# Altium project Projekat.PrjPcb
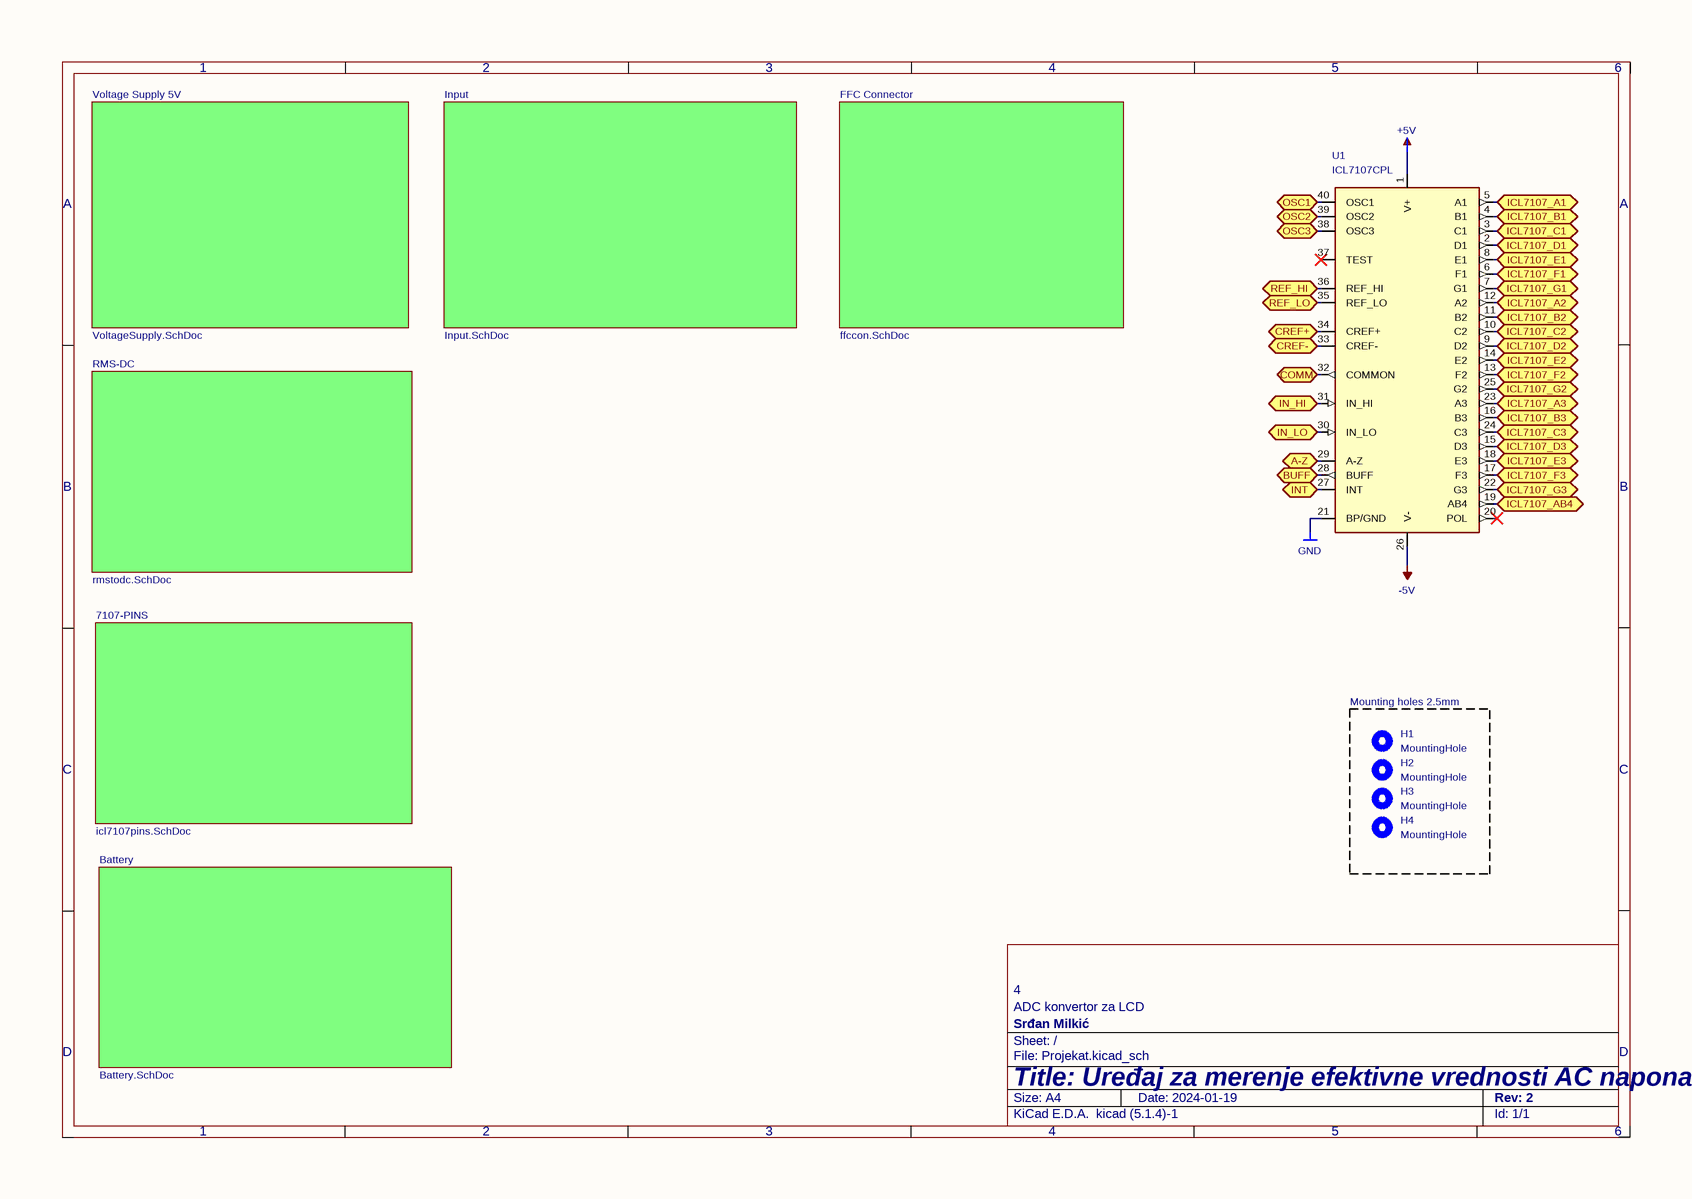
[diagram p0: Projekat.SchDoc]
8 sheets, 93 parts. Net scope: flat (ports and power ports of the same name join across sheets).
Board file: Projekat.PcbDoc
Sheets:
  Projekat.SchDoc
    Input = Input.SchDoc
    7107-PINS = icl7107pins.SchDoc
    Battery = Battery.SchDoc
    RMS-DC = rmstodc.SchDoc
    Voltage Supply 5V = VoltageSupply.SchDoc
    FFC Connector = ffccon.SchDoc
  lcdcontroll.SchDoc

## Sheet Projekat.SchDoc
size 297 x 209 mm

### Parts
#PWR1  GND
#PWR02  +5V
#PWR03  -5V
H1  MountingHole  [MountingHole_2.5mm]
H2  MountingHole  [MountingHole_2.5mm]
H3  MountingHole  [MountingHole_2.5mm]
H4  MountingHole  [MountingHole_2.5mm]
U1  ICL7107CPL  [DIP-40_W15.24mm]

### Blocks framed on the sheet
Mounting holes 2.5mm /: H1-H4

### Sub-sheets
7107-PINS = icl7107pins.SchDoc: no entries
Battery = Battery.SchDoc: no entries
FFC Connector = ffccon.SchDoc: no entries
Input = Input.SchDoc: no entries
RMS-DC = rmstodc.SchDoc: no entries
Voltage Supply 5V = VoltageSupply.SchDoc: no entries

### Ports
A-Z (bidir), BUFF (bidir), COMM (bidir), CREF+ (bidir), CREF- (bidir), ICL7107_A1 (bidir), ICL7107_A2 (bidir), ICL7107_A3 (bidir), ICL7107_AB4 (bidir), ICL7107_B1 (bidir), ICL7107_B2 (bidir), ICL7107_B3 (bidir), ICL7107_C1 (bidir), ICL7107_C2 (bidir), ICL7107_C3 (bidir), ICL7107_D1 (bidir), ICL7107_D2 (bidir), ICL7107_D3 (bidir), ICL7107_E1 (bidir), ICL7107_E2 (bidir), ICL7107_E3 (bidir), ICL7107_F1 (bidir), ICL7107_F2 (bidir), ICL7107_F3 (bidir), ICL7107_G1 (bidir), ICL7107_G2 (bidir), ICL7107_G3 (bidir), IN_HI (bidir), IN_LO (bidir), INT (bidir), OSC1 (bidir), OSC2 (bidir), OSC3 (bidir), REF_HI (bidir), REF_LO (bidir)

### Nets
A-Z: U1.29(A-Z) ; port A-Z
AD737_COM: U1.30(IN_LO) U1.32(COMMON) U1.35(REF_LO) ; port COMM, port REF_LO, port IN_LO
BUFF: U1.28(BUFF) ; port BUFF
CREF+: U1.34(CREF+) ; port CREF+
CREF-: U1.33(CREF-) ; port CREF-
ICL7107_A1: U1.5(A1) ; port ICL7107_A1
ICL7107_A2: U1.12(A2) ; port ICL7107_A2
ICL7107_A3: U1.23(A3) ; port ICL7107_A3
ICL7107_AB4: U1.19(AB4) ; port ICL7107_AB4
ICL7107_B1: U1.4(B1) ; port ICL7107_B1
ICL7107_B2: U1.11(B2) ; port ICL7107_B2
ICL7107_B3: U1.16(B3) ; port ICL7107_B3
ICL7107_C1: U1.3(C1) ; port ICL7107_C1
ICL7107_C2: U1.10(C2) ; port ICL7107_C2
ICL7107_C3: U1.24(C3) ; port ICL7107_C3
ICL7107_D1: U1.2(D1) ; port ICL7107_D1
ICL7107_D2: U1.9(D2) ; port ICL7107_D2
ICL7107_D3: U1.15(D3) ; port ICL7107_D3
ICL7107_E1: U1.8(E1) ; port ICL7107_E1
ICL7107_E2: U1.14(E2) ; port ICL7107_E2
ICL7107_E3: U1.18(E3) ; port ICL7107_E3
ICL7107_F1: U1.6(F1) ; port ICL7107_F1
ICL7107_F2: U1.13(F2) ; port ICL7107_F2
ICL7107_F3: U1.17(F3) ; port ICL7107_F3
ICL7107_G1: U1.7(G1) ; port ICL7107_G1
ICL7107_G2: U1.25(G2) ; port ICL7107_G2
ICL7107_G3: U1.22(G3) ; port ICL7107_G3
IN_HI: U1.31(IN_HI) ; port IN_HI
INT: U1.27(INT) ; port INT
OSC1: U1.40(OSC1) ; port OSC1
OSC2: U1.39(OSC2) ; port OSC2
OSC3: U1.38(OSC3) ; port OSC3
REF_HI: U1.36(REF_HI) ; port REF_HI
Net#PWR02_1: #PWR02.1(+5V) U1.1(V+)
Net#PWR03_1: #PWR03.1(-5V) U1.26(V-)

Not connected (* = marked no-connect by the designer): #PWR1 1(GND); U1 20(POL)* 21(BP/GND) 37(TEST)*

### Notes on the sheet
- 1
- 2
- 3
- 4
- 5
- 6
- A
- B
- C
- ADC konvertor za LCD
- D
- Title: Uređaj za merenje efektivne vrednosti AC napona
- File: Projekat.kicad_sch
- Sheet: /
- Srđan Milkić
- KiCad E.D.A.  kicad (5.1.4)-1
- Size: A4
- Date: 2024-01-19
- Rev: 2
- Id: 1/1

### Library data of the parts
#PWR1 = GND: Value: GND
#PWR02 = +5V: Value: +5V
#PWR03 = -5V: Value: -5V
H1-H4 = MountingHole: Value: MountingHole; Footprint: MountingHole:MountingHole_2.5mm
U1 = ICL7107CPL: Value: ICL7107CPL; Footprint: Package_DIP:DIP-40_W15.24mm

## Sheet Input.SchDoc
size 297 x 209 mm
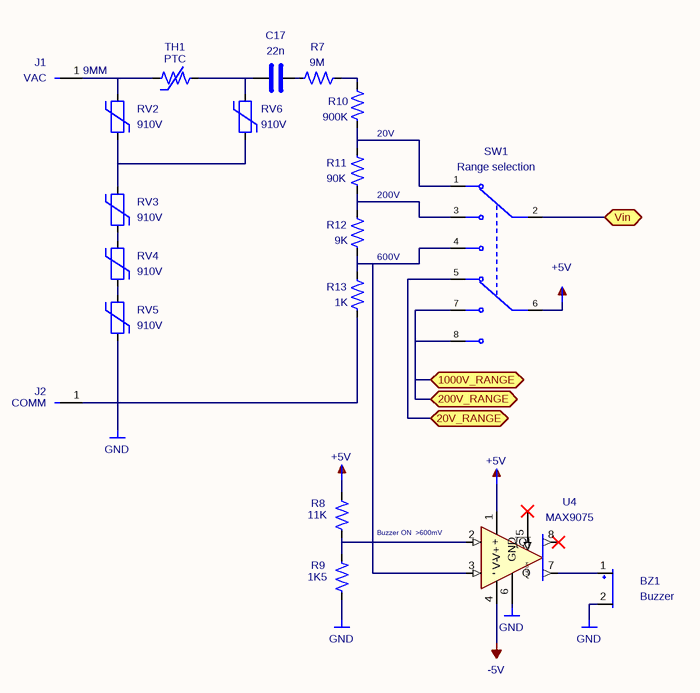
[diagram p1: Input.SchDoc]

### Parts
#PWR15  GND
#PWR016  +5V
#PWR17  GND
#PWR018  +5V
#PWR019  -5V
#PWR20  GND
#PWR021  +5V
#PWR22  GND
BZ1  Buzzer  [Buzzer_12x9.5RM7.6]
C17  22n  [C_Rect_L7.2mm_W11.0mm_P5.00mm_FKS2_FKP2_MKS2_MKP2]
J1  VAC  [TE_350180]
J2  COMM  [TE_350180]
R7  9M  [R_1210_3225Metric]
R8  11K  [R_1206_3216Metric]
R9  1K5  [R_1206_3216Metric]
R10  900K  [R_1210_3225Metric]
R11  90K  [R_1206_3216Metric]
R12  9K  [R_1206_3216Metric]
R13  1K  [R_1206_3216Metric]
RV2  910V  [RV_Disc_D12mm_W3.9mm_P7.5mm]
RV3  910V  [RV_Disc_D12mm_W3.9mm_P7.5mm]
RV4  910V  [RV_Disc_D12mm_W3.9mm_P7.5mm]
RV5  910V  [RV_Disc_D12mm_W3.9mm_P7.5mm]
RV6  910V  [RV_Disc_D12mm_W3.9mm_P7.5mm]
SW1  Range selection  [SW_EG2310]
TH1  PTC  [R_Axial_DIN0414_L11.9mm_D4.5mm_P7.62mm_Vertical]
U4  MAX9075  [SOT-23-8]

### Ports
20V_RANGE (bidir), 200V_RANGE (bidir), 1000V_RANGE (bidir), Vin (bidir)

### Nets
20V_RANGE: SW1.5 ; port 20V_RANGE
1000V_RANGE: SW1.7 SW1.8 ; port 200V_RANGE, port 1000V_RANGE
Vin: SW1.2 ; port Vin
Net#PWR016_1: #PWR016.1(+5V) R8.1
Net#PWR018_1: #PWR018.1(+5V) U4.1(V+)
Net#PWR019_1: #PWR019.1(-5V) U4.4(V-)
Net#PWR021_1: #PWR021.1(+5V) SW1.6
NetBZ1_1: BZ1.1(-) U4.7(Q)
NetC17_1: C17.1 RV6.1 TH1.2
NetC17_2: C17.2 R7.1
NetJ1_1: J1.1(Pin_1) RV2.1 TH1.1
NetJ2_1: J2.1(Pin_1) R13.2 RV5.2
NetR7_2: R7.2 R10.2
NetR8_2: R8.2 R9.1 U4.2(+)
NetR10_1: R10.1 R11.1 SW1.1
NetR11_2: R11.2 R12.1 SW1.3
NetR12_2: R12.2 R13.1 SW1.4 U4.3(-)
NetRV2_2: RV2.2 RV3.1 RV6.2
NetRV3_2: RV3.2 RV4.1
NetRV4_2: RV4.2 RV5.1

Not connected (* = marked no-connect by the designer): #PWR15 1(GND); #PWR17 1(GND); #PWR20 1(GND); #PWR22 1(GND); BZ1 2(+); R9 2; U4 5(LATCH)* 6(GND) 8(~{{Q}})*

### Notes on the sheet
- 9MM
- 20V
- 200V
- 600V
- Buzzer ON  >600mV
- 1
- 2
- 3
- 4
- 5
- 6
- A
- B
- C
- Izbor opsega
- Zujalica za prekomerni napon
- Zaštita ulaza
- D
- Title: Uređaj za merenje efektivne vrednosti AC napona
- File: Input.kicad_sch
- Sheet: /
- Srđan Milkić
- KiCad E.D.A.  kicad (5.1.4)-1
- Size: A4
- Date: 2024-01-19
- Rev: 2
- Id: 1/1

### Library data of the parts
#PWR17 = GND_2: Value: GND
#PWR20 #PWR22 = GND_1: Value: GND
C17 = C: Rated Voltage: 1200V; Value: 22n; Footprint: Capacitor_THT:C_Rect_L7.2mm_W11.0mm_P5.00mm_FKS2_FKP2_MKS2_MKP2
J1 J2 = Conn_01x01_Female: Footprint: priums_lib:TE_350180
  J1: Value: VAC
  J2: Value: COMM
R7-R13 = R_US
  R7: Value: 9M; Footprint: Resistor_SMD:R_1210_3225Metric
  R8: Value: 11K; Footprint: Resistor_SMD:R_1206_3216Metric
  R9: Value: 1K5; Footprint: Resistor_SMD:R_1206_3216Metric
  R10: Value: 900K; Footprint: Resistor_SMD:R_1210_3225Metric
  R11: Value: 90K; Footprint: Resistor_SMD:R_1206_3216Metric
  R12: Value: 9K; Footprint: Resistor_SMD:R_1206_3216Metric
  R13: Value: 1K; Footprint: Resistor_SMD:R_1206_3216Metric
RV2 = Varistor_1: Value: 910V; Footprint: Varistor:RV_Disc_D12mm_W3.9mm_P7.5mm
RV3 = Varistor_2: Value: 910V; Footprint: Varistor:RV_Disc_D12mm_W3.9mm_P7.5mm
RV4 = Varistor_3: Value: 910V; Footprint: Varistor:RV_Disc_D12mm_W3.9mm_P7.5mm
RV5 = Varistor: Value: 910V; Footprint: Varistor:RV_Disc_D12mm_W3.9mm_P7.5mm
RV6 = Varistor_4: Value: 910V; Footprint: Varistor:RV_Disc_D12mm_W3.9mm_P7.5mm
SW1 = EG2310: MF: E-Switch; Description: \nSlide Switch DP3T Through Hole, Right Angle\n; MAXIMUM_PACKAGE_HEIGHT: 4.7mm; Package: None; Price: None; Check_prices: https://www.snapeda.com/parts/EG2310/E-Switch/view-part/?ref=eda; STANDARD: Manufacturer Recommendations; PARTREV: -; SnapEDA_Link: https://www.snapeda.com/parts/EG2310/E-Switch/view-part/?ref=snap; MP: EG2310; Purchase-URL: https://www.snapeda.com/api/url_track_click_mouser/?unipart_id=396456&manufacturer=E-Switch&part_name=EG2310&search_term=None; MANUFACTURER: E-Switch; Availability: In Stock; SNAPEDA_PN: EG2310; Value: Range selection; Footprint: priums_lib:SW_EG2310
TH1 = Thermistor_US: Value: PTC; Footprint: Resistor_THT:R_Axial_DIN0414_L11.9mm_D4.5mm_P7.62mm_Vertical
U4 = AD8561: Value: MAX9075; Footprint: Package_TO_SOT_SMD:SOT-23-8
#PWR15 = GND: Value: GND
#PWR016 #PWR018 #PWR021 = +5V: Value: +5V
#PWR019 = -5V: Value: -5V
BZ1 = Buzzer: Value: Buzzer; Footprint: Buzzer_Beeper:Buzzer_12x9.5RM7.6

## Sheet icl7107pins.SchDoc
size 297 x 209 mm
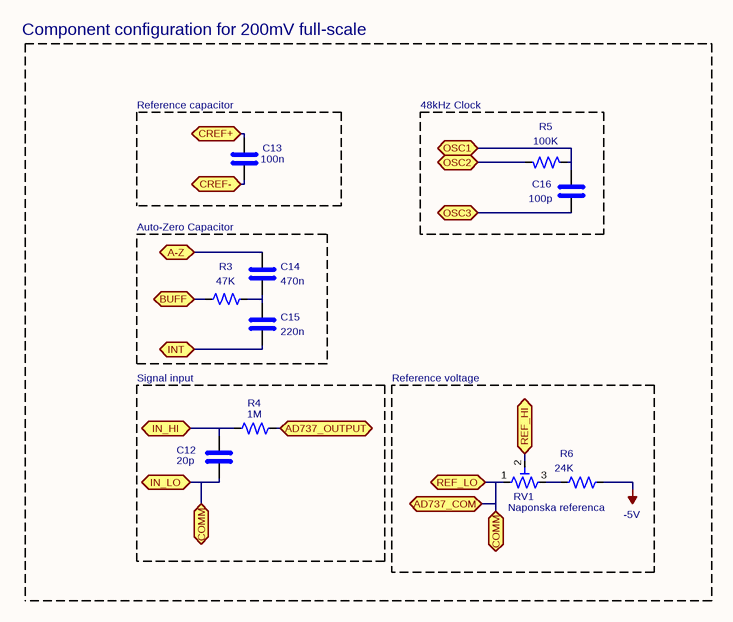
[diagram p2: icl7107pins.SchDoc]

### Parts
#PWR014  -5V
C12  20p  [C_1210_3225Metric]
C13  100n  [C_1210_3225Metric]
C14  470n  [C_1206_3216Metric]
C15  220n  [C_1206_3216Metric]
C16  100p  [C_1206_3216Metric]
R3  47K  [R_1206_3216Metric]
R4  1M  [R_1812_4532Metric]
R5  100K  [R_1206_3216Metric]
R6  24K  [R_1206_3216Metric]
RV1  Naponska referenca  [Potentiometer_Bourns_3266W_Vertical]

### Blocks framed on the sheet
Reference capacitor /: C13
48kHz Clock: C16 R5
Auto-Zero Capacitor /: C14 C15 R3
Signal input: C12 R4
Reference voltage: #PWR014 R6 RV1

### Ports
A-Z (bidir), AD737_COM (bidir), AD737_OUTPUT (bidir), BUFF (bidir), COMM (bidir), CREF+ (bidir), CREF- (bidir), IN_HI (bidir), IN_LO (bidir), INT (bidir), OSC1 (bidir), OSC2 (bidir), OSC3 (bidir), REF_HI (bidir), REF_LO (bidir)

### Nets
A-Z: C14.2 ; port A-Z
AD737_COM: C12.2 RV1.1 ; port AD737_COM, port REF_LO, port COMM, port IN_LO
AD737_OUTPUT: R4.2 ; port AD737_OUTPUT
BUFF: R3.1 ; port BUFF
CREF+: C13.1 ; port CREF+
CREF-: C13.2 ; port CREF-
IN_HI: C12.1 R4.1 ; port IN_HI
INT: C15.1 ; port INT
OSC1: C16.1 R5.1 ; port OSC1
OSC2: R5.2 ; port OSC2
OSC3: C16.2 ; port OSC3
REF_HI: RV1.2 ; port REF_HI
Net#PWR014_1: #PWR014.1(-5V) R6.1
NetC14_1: C14.1 C15.2 R3.2
NetR6_2: R6.2 RV1.3

### Notes on the sheet
- Component configuration for 200mV full-scale
- 1
- 2
- 3
- 4
- 5
- 6
- A
- B
- C
- Konfiguracija ICL7107 ADC konvertora
- D
- Title: Uređaj za merenje efektivne vrednosti AC napona
- File: icl7107pins.kicad_sch
- Sheet: /
- Srđan Milkić
- KiCad E.D.A.  kicad (5.1.4)-1
- Size: A4
- Date: 2024-01-19
- Rev: 2
- Id: 1/1

### Library data of the parts
C12-C16 = C
  C12: Value: 20p; Footprint: Capacitor_SMD:C_1210_3225Metric
  C13: Value: 100n; Footprint: Capacitor_SMD:C_1210_3225Metric
  C14: Value: 470n; Footprint: Capacitor_SMD:C_1206_3216Metric
  C15: Value: 220n; Footprint: Capacitor_SMD:C_1206_3216Metric
  C16: Value: 100p; Footprint: Capacitor_SMD:C_1206_3216Metric
R3-R6 = R_US
  R3: Value: 47K; Footprint: Resistor_SMD:R_1206_3216Metric
  R4: Value: 1M; Footprint: Resistor_SMD:R_1812_4532Metric
  R5: Value: 100K; Footprint: Resistor_SMD:R_1206_3216Metric
  R6: Value: 24K; Footprint: Resistor_SMD:R_1206_3216Metric
RV1 = R_Potentiometer_Trim_US: Value: Naponska referenca; Footprint: Potentiometer_THT:Potentiometer_Bourns_3266W_Vertical
#PWR014 = -5V: Value: -5V

## Sheet Battery.SchDoc
size 297 x 209 mm
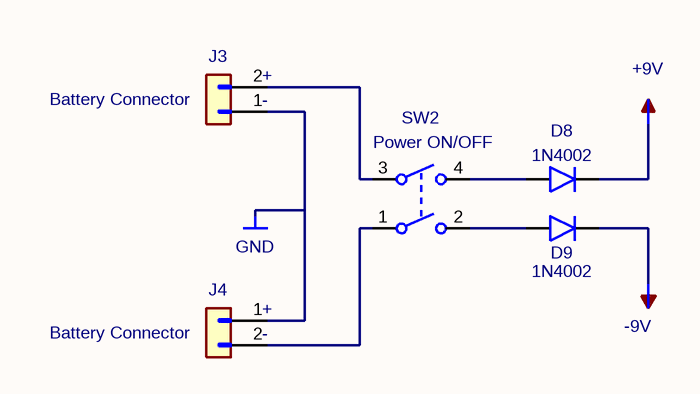
[diagram p3: Battery.SchDoc]

### Parts
#PWR23  GND
#PWR024  +9V
#PWR025  -9V
D8  1N4002  [D_DO-41_SOD81_P10.16mm_Horizontal]
D9  1N4002  [D_DO-41_SOD81_P10.16mm_Horizontal]
J3  Battery Connector  [PinHeader_1x02_P2.54mm_Vertical]
J4  Battery Connector  [PinHeader_1x02_P2.54mm_Vertical]
SW2  Power ON/OFF  [SW_CuK_JS202011AQN_DPDT_Angled]

### Nets
Net#PWR024_1: #PWR024.1(+9V) D8.1(K)
Net#PWR025_1: #PWR025.1(-9V) D9.1(K)
NetD8_2: D8.2(A) SW2.4
NetD9_2: D9.2(A) SW2.2
NetJ3_1: J3.1(Pin_1) J4.1(Pin_1)
NetJ3_2: J3.2(Pin_2) SW2.3
NetJ4_2: J4.2 SW2.1

Not connected (* = marked no-connect by the designer): #PWR23 1(GND)

### Notes on the sheet
- (near J3) +
- (near J3) -
- (near J4) -
- (near J4) +
- 1
- 2
- 3
- 4
- 5
- 6
- A
- B
- C
- Baterijsko napajanje
- D
- Title: Uređaj za merenje efektivne vrednosti AC napona
- File: Battery.kicad_sch
- Sheet: /
- Srđan Milkić
- KiCad E.D.A.  kicad (5.1.4)-1
- Size: A4
- Date: 2024-01-19
- Rev: 2
- Id: 1/1

### Library data of the parts
J3 = Conn_01x02_1: Value: Battery Connector; Footprint: Connector_PinHeader_2.54mm:PinHeader_1x02_P2.54mm_Vertical
J4 = Conn_01x02: Value: Battery Connector; Footprint: Connector_PinHeader_2.54mm:PinHeader_1x02_P2.54mm_Vertical
SW2 = SW_DPST: Value: Power ON/OFF; Footprint: Button_Switch_THT:SW_CuK_JS202011AQN_DPDT_Angled
#PWR23 = GND: Value: GND
#PWR024 = +9V: Value: +9V
#PWR025 = -9V: Value: -9V
D8 D9 = 1N4002: Value: 1N4002; Footprint: Diode_THT:D_DO-41_SOD81_P10.16mm_Horizontal

## Sheet rmstodc.SchDoc
size 297 x 209 mm
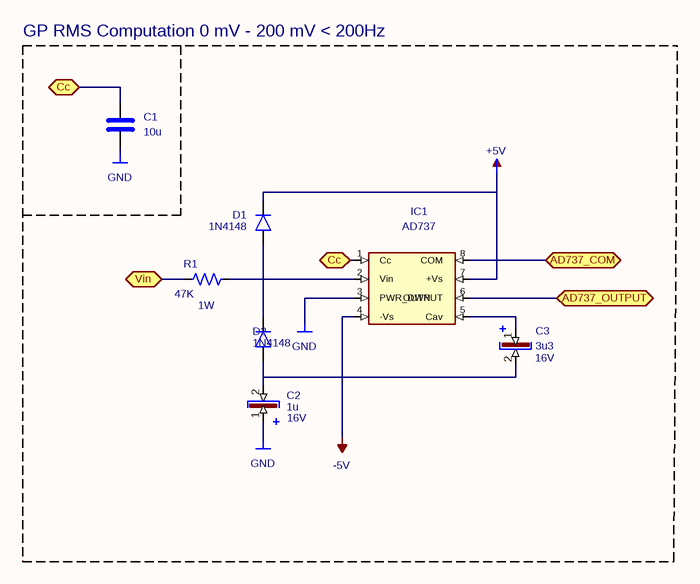
[diagram p4: rmstodc.SchDoc]

### Parts
#PWR4  GND
#PWR5  GND
#PWR6  GND
#PWR07  -5V
#PWR08  +5V
C1  10u  [C_1206_3216Metric]
C2  Rated Voltage: 16V  [C_1210_3225Metric]  (hidden comment: 1u)
C3  Rated Voltage: 16V  [C_1210_3225Metric]  (hidden comment: 3u3)
D1  1N4148  [D_DO-35_SOD27_P7.62mm_Horizontal]
D2  1N4148  [D_DO-35_SOD27_P7.62mm_Horizontal]
IC1  AD737  [DIP-8_W10.16mm]
R1  Power Rating: 1W  [R_1206_3216Metric]  (hidden comment: 47K)

### Blocks framed on the sheet
GP RMS Computation / 0 mV - 200 mV / < 200Hz: #PWR4-#PWR6 #PWR07 #PWR08 C1-C3 D1 D2 IC1 R1

### Ports
AD737_COM (bidir), AD737_OUTPUT (bidir), Cc (bidir), Vin (bidir)

### Nets
AD737_COM: IC1.8(COM) ; port AD737_COM
AD737_OUTPUT: IC1.6(OUTPUT) ; port AD737_OUTPUT
Cc: C1.1 IC1.1(Cc) ; port Cc
Vin: R1.2 ; port Vin
Net#PWR07_1: #PWR07.1(-5V) C2.2 C3.2 D2.2(A) IC1.4(-Vs)
Net#PWR08_1: #PWR08.1(+5V) D1.1(K) IC1.7(+Vs)
NetC3_1: C3.1 IC1.5(Cav)
NetD1_2: D1.2(A) D2.1(K) IC1.2(Vin) R1.1

Not connected (* = marked no-connect by the designer): #PWR4 1(GND); #PWR5 1(GND); #PWR6 1(GND); C1 2; C2 1; IC1 3(PWR_DWN)

### Notes on the sheet
- 1
- 2
- 3
- 4
- 5
- 6
- A
- B
- C
- AC - DC konvertor
- D
- Title: Uređaj za merenje efektivne vrednosti AC napona
- File: rmstodc.kicad_sch
- Sheet: /
- Srđan Milkić
- KiCad E.D.A.  kicad (5.1.4)-1
- Size: A4
- Date: 2024-01-19
- Rev: 2
- Id: 1/1

### Library data of the parts
#PWR4 = GND_1: Value: GND
#PWR5 = GND_2: Value: GND
C1 = C: Value: 10u; Footprint: Capacitor_SMD:C_1206_3216Metric
C2 = Cap_pol: Value: 1u; Footprint: Capacitor_SMD:C_1210_3225Metric
C3 = Cap_pol_1: Value: 3u3; Footprint: Capacitor_SMD:C_1210_3225Metric
D1 = 1N4148_1: Value: 1N4148; Footprint: Diode_THT:D_DO-35_SOD27_P7.62mm_Horizontal
R1 = R_US: Value: 47K; Footprint: Resistor_SMD:R_1206_3216Metric
#PWR6 = GND: Value: GND
#PWR07 = -5V: Value: -5V
#PWR08 = +5V: Value: +5V
D2 = 1N4148: Value: 1N4148; Footprint: Diode_THT:D_DO-35_SOD27_P7.62mm_Horizontal
IC1 = AD737: Value: AD737; Footprint: Package_DIP:DIP-8_W10.16mm

## Sheet VoltageSupply.SchDoc
size 297 x 209 mm
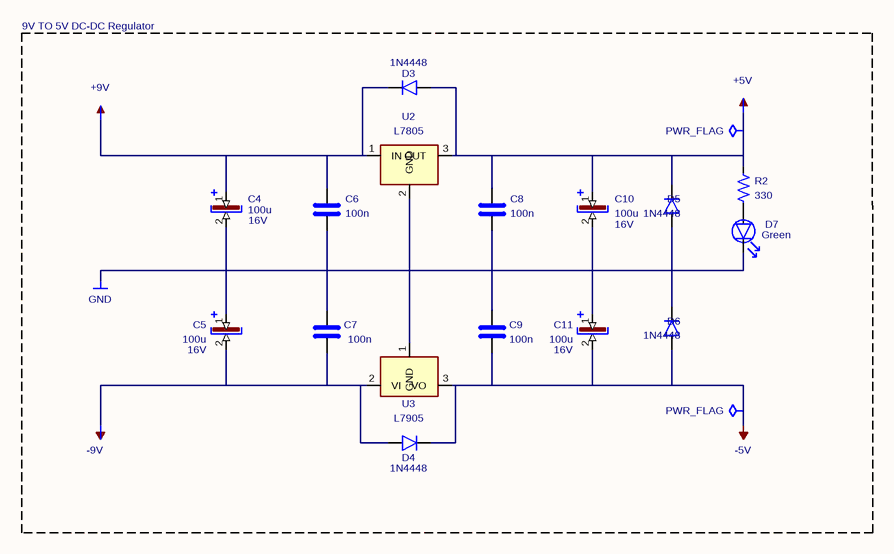
[diagram p5: VoltageSupply.SchDoc]

### Parts
(Parts that share a designator on the sheet are numbered #1, #2 ... from top to bottom, then left to right.)
#FLG01  PWR_FLAG  (graphical)
#FLG02  PWR_FLAG  (graphical)
#PWR09  +9V
#PWR10  GND
#PWR011  -9V
#PWR012  +5V
#PWR013  -5V
C4  Rated Voltage: 16V  [C_1210_3225Metric]  (hidden comment: 100u)
C5  Rated Voltage: 16V  [C_1210_3225Metric]  (hidden comment: 100u)
C6  100n  [C_1210_3225Metric]
C7  100n  [C_1210_3225Metric]
C8  100n  [C_1210_3225Metric]
C9  100n  [C_1210_3225Metric]
C10  Rated Voltage: 16V  [C_1206_3216Metric]  (hidden comment: 100u)
C11  Rated Voltage: 16V  [C_1206_3216Metric]  (hidden comment: 100u)
D3  1N4448  [D_DO-35_SOD27_P7.62mm_Horizontal]
D4  1N4448  [D_DO-35_SOD27_P7.62mm_Horizontal]
D5  1N4448  [D_DO-35_SOD27_P7.62mm_Horizontal]
D6  1N4448  [D_DO-35_SOD27_P7.62mm_Horizontal]
D7  Green  [LED_D5.0mm_Horizontal_O6.35mm_Z15.0mm]
R2  330  [R_1206_3216Metric]
U2#1  L7805  [TO-220-3_Vertical]
U3  L7905  [TO-220-3_Vertical]

### Blocks framed on the sheet
9V TO 5V DC-DC Regulator /: #FLG01 #FLG02 #PWR09 #PWR10 #PWR011 #PWR012 #PWR013 C4-C11 D3-D7 R2 U2#1 U3

### Nets
Net#FLG01_1: #FLG01.1(pwr) #PWR012.1(+5V) C8.1 C10.1 D3.2(A) D5.1(K) R2.1 U2#1.3(OUT)
Net#FLG02_1: #FLG02.1(pwr) #PWR013.1(-5V) C9.1 C11.2 D4.1(K) D6.2(A) U3.3(VO)
Net#PWR09_1: #PWR09.1(+9V) C4.1 C6.1 D3.1(K) U2#1.1(IN)
Net#PWR011_1: #PWR011.1(-9V) C5.2 C7.1 D4.2(A) U3.2(VI)
NetC4_2: C4.2 C5.1 C6.2 C7.2 C8.2 C9.2 C10.2 C11.1 D5.2(A) D6.1(K) D7.1(K) U2#1.2(GND) U3.1(GND)
NetD7_2: D7.2(A) R2.2

Not connected (* = marked no-connect by the designer): #PWR10 1(GND)

### Notes on the sheet
- 1
- 2
- 3
- 4
- 5
- 6
- A
- B
- C
- Bipolarno napajanje za 5V
- D
- Title: Uređaj za merenje efektivne vrednosti AC napona
- File: VoltageSupply.kicad_sch
- Sheet: /
- Srđan Milkić
- KiCad E.D.A.  kicad (5.1.4)-1
- Size: A4
- Date: 2024-01-19
- Rev: 2
- Id: 1/1

### Library data of the parts
C4 C5 = Cap_pol: Value: 100u; Footprint: Capacitor_SMD:C_1210_3225Metric
C6-C9 = C: Value: 100n; Footprint: Capacitor_SMD:C_1210_3225Metric
C10 = Cap_pol_2: Value: 100u; Footprint: Capacitor_SMD:C_1206_3216Metric
C11 = Cap_pol_1: Value: 100u; Footprint: Capacitor_SMD:C_1206_3216Metric
D7 = LED: Value: Green; Footprint: LED_THT:LED_D5.0mm_Horizontal_O6.35mm_Z15.0mm
R2 = R_US: Value: 330; Footprint: Resistor_SMD:R_1206_3216Metric
#FLG01 #FLG02 = PWR_FLAG: Value: PWR_FLAG
#PWR09 = +9V: Value: +9V
#PWR10 = GND: Value: GND
#PWR011 = -9V: Value: -9V
#PWR012 = +5V: Value: +5V
#PWR013 = -5V: Value: -5V
D3-D6 = 1N4448: Value: 1N4448; Footprint: Diode_THT:D_DO-35_SOD27_P7.62mm_Horizontal
U2#1 = L7805: Value: L7805; Footprint: Package_TO_SOT_THT:TO-220-3_Vertical
U3 = L7905: Value: L7905; Footprint: Package_TO_SOT_THT:TO-220-3_Vertical

## Sheet ffccon.SchDoc
size 297 x 209 mm
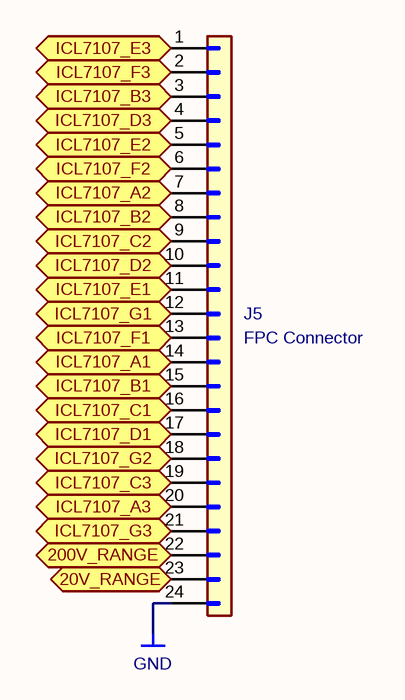
[diagram p6: ffccon.SchDoc]

### Parts
#PWR26  GND
J5  FPC Connector  [FPC_24]

### Ports
20V_RANGE (bidir), 200V_RANGE (bidir), ICL7107_A1 (bidir), ICL7107_A2 (bidir), ICL7107_A3 (bidir), ICL7107_B1 (bidir), ICL7107_B2 (bidir), ICL7107_B3 (bidir), ICL7107_C1 (bidir), ICL7107_C2 (bidir), ICL7107_C3 (bidir), ICL7107_D1 (bidir), ICL7107_D2 (bidir), ICL7107_D3 (bidir), ICL7107_E1 (bidir), ICL7107_E2 (bidir), ICL7107_E3 (bidir), ICL7107_F1 (bidir), ICL7107_F2 (bidir), ICL7107_F3 (bidir), ICL7107_G1 (bidir), ICL7107_G2 (bidir), ICL7107_G3 (bidir)

### Nets
20V_RANGE: J5.23(Pin_23) ; port 20V_RANGE
1000V_RANGE: J5.22(Pin_22) ; port 200V_RANGE
ICL7107_A1: J5.14(Pin_14) ; port ICL7107_A1
ICL7107_A2: J5.7(Pin_7) ; port ICL7107_A2
ICL7107_A3: J5.20(Pin_20) ; port ICL7107_A3
ICL7107_B1: J5.15(Pin_15) ; port ICL7107_B1
ICL7107_B2: J5.8(Pin_8) ; port ICL7107_B2
ICL7107_B3: J5.3(Pin_3) ; port ICL7107_B3
ICL7107_C1: J5.16(Pin_16) ; port ICL7107_C1
ICL7107_C2: J5.9(Pin_9) ; port ICL7107_C2
ICL7107_C3: J5.19(Pin_19) ; port ICL7107_C3
ICL7107_D1: J5.17(Pin_17) ; port ICL7107_D1
ICL7107_D2: J5.10(Pin_10) ; port ICL7107_D2
ICL7107_D3: J5.4(Pin_4) ; port ICL7107_D3
ICL7107_E1: J5.11(Pin_11) ; port ICL7107_E1
ICL7107_E2: J5.5(Pin_5) ; port ICL7107_E2
ICL7107_E3: J5.1(Pin_1) ; port ICL7107_E3
ICL7107_F1: J5.13(Pin_13) ; port ICL7107_F1
ICL7107_F2: J5.6(Pin_6) ; port ICL7107_F2
ICL7107_F3: J5.2(Pin_2) ; port ICL7107_F3
ICL7107_G1: J5.12(Pin_12) ; port ICL7107_G1
ICL7107_G2: J5.18(Pin_18) ; port ICL7107_G2
ICL7107_G3: J5.21(Pin_21) ; port ICL7107_G3

Not connected (* = marked no-connect by the designer): #PWR26 1(GND); J5 24(Pin_24)

### Notes on the sheet
- 1
- 2
- 3
- 4
- 5
- 6
- A
- B
- C
- Konektor FFC trake za povezivanje LCD-a
- D
- Title: Uređaj za merenje efektivne vrednosti AC napona
- File: ffccon.kicad_sch
- Sheet: /
- Srđan Milkić
- KiCad E.D.A.  kicad (5.1.4)-1
- Size: A4
- Date: 2024-01-19
- Rev: 2
- Id: 1/1

### Library data of the parts
J5 = Conn_01x24: Value: FPC Connector; Footprint: priums_lib:FPC_24
#PWR26 = GND: Value: GND

## Sheet lcdcontroll.SchDoc
size 297 x 209 mm
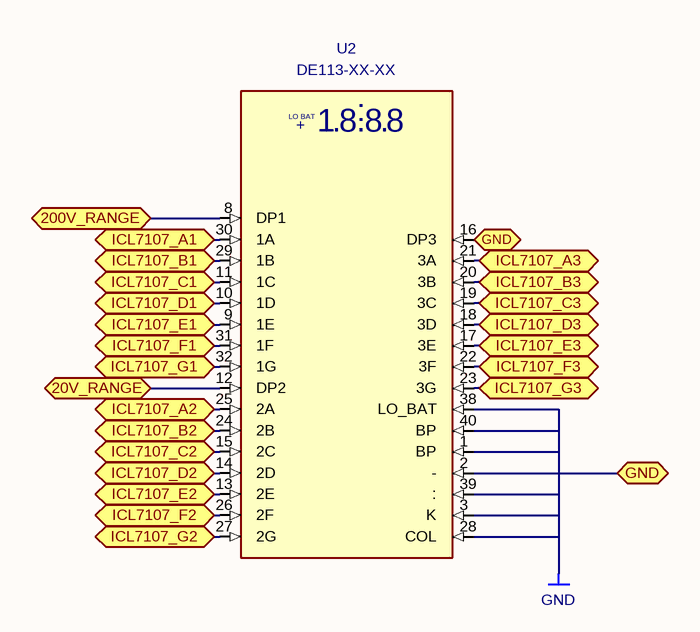
[diagram p7: lcdcontroll.SchDoc]

### Parts
(Parts that share a designator on the sheet are numbered #1, #2 ... from top to bottom, then left to right.)
#1  GND
U2#2  DE113-XX-XX  [DE113-XX-XX]

### Ports
20V_RANGE (bidir), 200V_RANGE (bidir), GND (bidir), ICL7107_A1 (bidir), ICL7107_A2 (bidir), ICL7107_A3 (bidir), ICL7107_B1 (bidir), ICL7107_B2 (bidir), ICL7107_B3 (bidir), ICL7107_C1 (bidir), ICL7107_C2 (bidir), ICL7107_C3 (bidir), ICL7107_D1 (bidir), ICL7107_D2 (bidir), ICL7107_D3 (bidir), ICL7107_E1 (bidir), ICL7107_E2 (bidir), ICL7107_E3 (bidir), ICL7107_F1 (bidir), ICL7107_F2 (bidir), ICL7107_F3 (bidir), ICL7107_G1 (bidir), ICL7107_G2 (bidir), ICL7107_G3 (bidir)

### Nets
20V_RANGE: U2#2.12(DP2) ; port 20V_RANGE
1000V_RANGE: U2#2.8(DP1) ; port 200V_RANGE
GND: U2#2.1(BP) U2#2.2(-) U2#2.3(K) U2#2.16(DP3) U2#2.28(COL) U2#2.38(LO_BAT) U2#2.39(:) U2#2.40(BP) ; port GND
ICL7107_A1: U2#2.30(1A) ; port ICL7107_A1
ICL7107_A2: U2#2.25(2A) ; port ICL7107_A2
ICL7107_A3: U2#2.21(3A) ; port ICL7107_A3
ICL7107_B1: U2#2.29(1B) ; port ICL7107_B1
ICL7107_B2: U2#2.24(2B) ; port ICL7107_B2
ICL7107_B3: U2#2.20(3B) ; port ICL7107_B3
ICL7107_C1: U2#2.11(1C) ; port ICL7107_C1
ICL7107_C2: U2#2.15(2C) ; port ICL7107_C2
ICL7107_C3: U2#2.19(3C) ; port ICL7107_C3
ICL7107_D1: U2#2.10(1D) ; port ICL7107_D1
ICL7107_D2: U2#2.14(2D) ; port ICL7107_D2
ICL7107_D3: U2#2.18(3D) ; port ICL7107_D3
ICL7107_E1: U2#2.9(1E) ; port ICL7107_E1
ICL7107_E2: U2#2.13(2E) ; port ICL7107_E2
ICL7107_E3: U2#2.17(3E) ; port ICL7107_E3
ICL7107_F1: U2#2.31(1F) ; port ICL7107_F1
ICL7107_F2: U2#2.26(2F) ; port ICL7107_F2
ICL7107_F3: U2#2.22(3F) ; port ICL7107_F3
ICL7107_G1: U2#2.32(1G) ; port ICL7107_G1
ICL7107_G2: U2#2.27(2G) ; port ICL7107_G2
ICL7107_G3: U2#2.23(3G) ; port ICL7107_G3

Not connected (* = marked no-connect by the designer): #1 1(GND); U2#2 4(NC) 5(NC) 6(NC) 7(NC) 33(NC) 34(NC) 35(NC) 36(NC) 37(NC)

### Notes on the sheet
- 1
- 2
- 3
- 4
- 5
- 6
- A
- B
- C
- D
- Title:
- File: lcdcontroll.kicad_sch
- Sheet: /
- KiCad E.D.A.  kicad (5.1.4)-1
- Size: A4
- Date:
- Rev:
- Id: 1/1
- (in symbol DE113-XX-XX) LO BAT; +; .

### Library data of the parts
#1 = GND: Value: GND
U2#2 = DE113-XX-XX: Value: DE113-XX-XX; Footprint: Display_7Segment:DE113-XX-XX

## Nets that join several sheets
20V_RANGE: Input (SW1.5), ffccon (J5.23), lcdcontroll (U2#2.12)
1000V_RANGE: Input (SW1.7 SW1.8), ffccon (J5.22), lcdcontroll (U2#2.8)
A-Z: Projekat (U1.29), icl7107pins (C14.2)
AD737_COM: Projekat (U1.30 U1.32 U1.35), icl7107pins (C12.2 RV1.1), rmstodc (IC1.8)
AD737_OUTPUT: icl7107pins (R4.2), rmstodc (IC1.6)
BUFF: Projekat (U1.28), icl7107pins (R3.1)
CREF+: Projekat (U1.34), icl7107pins (C13.1)
CREF-: Projekat (U1.33), icl7107pins (C13.2)
ICL7107_A1: Projekat (U1.5), ffccon (J5.14), lcdcontroll (U2#2.30)
ICL7107_A2: Projekat (U1.12), ffccon (J5.7), lcdcontroll (U2#2.25)
ICL7107_A3: Projekat (U1.23), ffccon (J5.20), lcdcontroll (U2#2.21)
ICL7107_B1: Projekat (U1.4), ffccon (J5.15), lcdcontroll (U2#2.29)
ICL7107_B2: Projekat (U1.11), ffccon (J5.8), lcdcontroll (U2#2.24)
ICL7107_B3: Projekat (U1.16), ffccon (J5.3), lcdcontroll (U2#2.20)
ICL7107_C1: Projekat (U1.3), ffccon (J5.16), lcdcontroll (U2#2.11)
ICL7107_C2: Projekat (U1.10), ffccon (J5.9), lcdcontroll (U2#2.15)
ICL7107_C3: Projekat (U1.24), ffccon (J5.19), lcdcontroll (U2#2.19)
ICL7107_D1: Projekat (U1.2), ffccon (J5.17), lcdcontroll (U2#2.10)
ICL7107_D2: Projekat (U1.9), ffccon (J5.10), lcdcontroll (U2#2.14)
ICL7107_D3: Projekat (U1.15), ffccon (J5.4), lcdcontroll (U2#2.18)
ICL7107_E1: Projekat (U1.8), ffccon (J5.11), lcdcontroll (U2#2.9)
ICL7107_E2: Projekat (U1.14), ffccon (J5.5), lcdcontroll (U2#2.13)
ICL7107_E3: Projekat (U1.18), ffccon (J5.1), lcdcontroll (U2#2.17)
ICL7107_F1: Projekat (U1.6), ffccon (J5.13), lcdcontroll (U2#2.31)
ICL7107_F2: Projekat (U1.13), ffccon (J5.6), lcdcontroll (U2#2.26)
ICL7107_F3: Projekat (U1.17), ffccon (J5.2), lcdcontroll (U2#2.22)
ICL7107_G1: Projekat (U1.7), ffccon (J5.12), lcdcontroll (U2#2.32)
ICL7107_G2: Projekat (U1.25), ffccon (J5.18), lcdcontroll (U2#2.27)
ICL7107_G3: Projekat (U1.22), ffccon (J5.21), lcdcontroll (U2#2.23)
IN_HI: Projekat (U1.31), icl7107pins (C12.1 R4.1)
INT: Projekat (U1.27), icl7107pins (C15.1)
OSC1: Projekat (U1.40), icl7107pins (C16.1 R5.1)
OSC2: Projekat (U1.39), icl7107pins (R5.2)
OSC3: Projekat (U1.38), icl7107pins (C16.2)
REF_HI: Projekat (U1.36), icl7107pins (RV1.2)
Vin: Input (SW1.2), rmstodc (R1.2)